# EAGLE schematic Companion_bot_schematic (EAGLE 9.7.0)
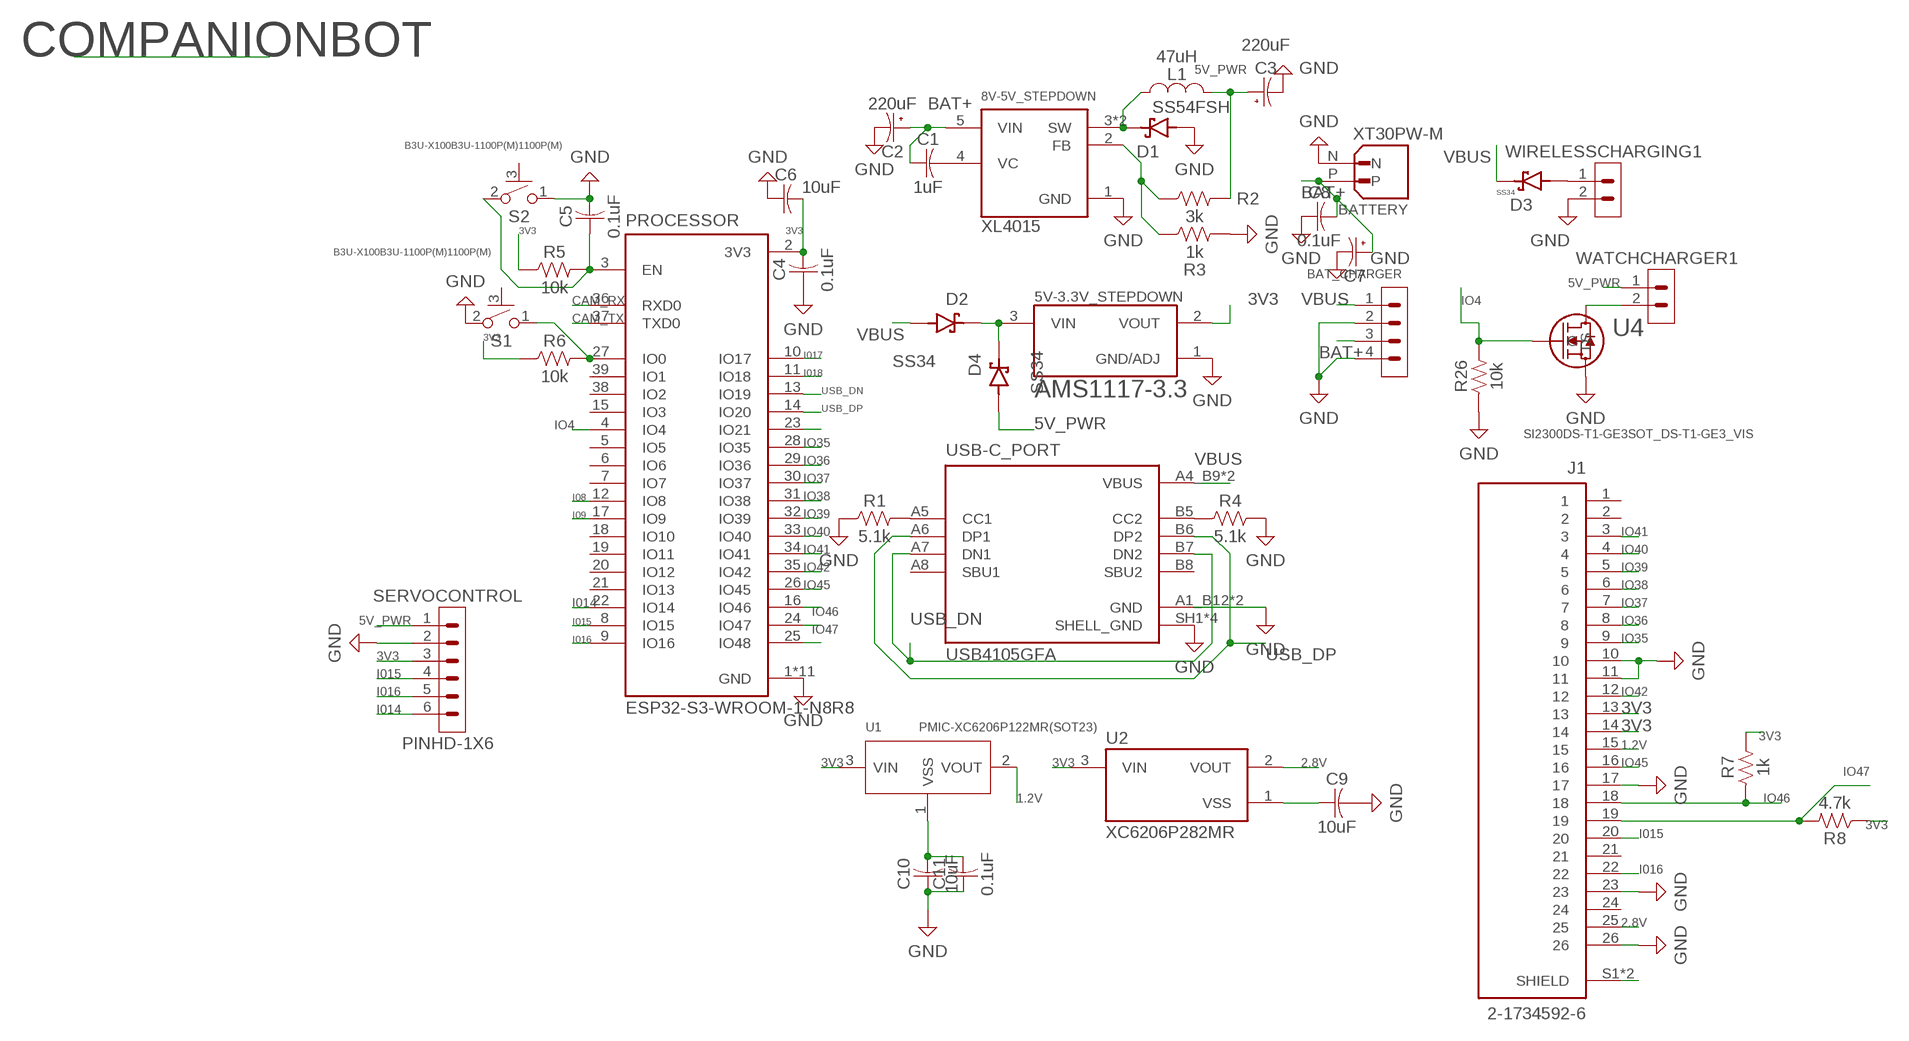
[diagram p0: schematic, sheet 1]

## Parts
5V-3.3V_STEPDOWN  AMS1117-3.3  [SOT229P700X180-4N]
8V-5V_STEPDOWN  XL4015  [CONV_XL4015]
BAT_CHARGER  PINHD-1X4  [1X04]
BATTERY  XT30PW-M  [AMASS_XT30PW-M]
C1  1uF  C-US_CHIP-0402(1005-METRIC)  [CAPC1005X60]
C2  220uF  C-POL-US_TANTALUM-1206(3216-METRIC)  [CAPMP3216X180N]
C3  220uF  C-POL-US_TANTALUM-1206(3216-METRIC)  [CAPMP3216X180N]
C4  0.1uF  C-US_CHIP-0402(1005-METRIC)  [CAPC1005X60]
C5  0.1uF  C-US_CHIP-0402(1005-METRIC)  [CAPC1005X60]
C6  10uF  C-US_CHIP-0402(1005-METRIC)  [CAPC1005X60]
C7  C-POL-US_TANTALUM-1206(3216-METRIC)  [CAPMP3216X180N]
C8  0.1uF  C-US_CHIP-0402(1005-METRIC)  [CAPC1005X60]
C9  10uF  C-US_CHIP-0402(1005-METRIC)  [CAPC1005X60]
C10  10uF  C-US_CHIP-0402(1005-METRIC)  [CAPC1005X60]
C11  0.1uF  C-US_CHIP-0402(1005-METRIC)  [CAPC1005X60]
D1  SS54FSH  [SODFL4725X110N]
D2  SS34  [DIO_SS34]
D3  SS34  [DIO_SS34]
D4  SS34  [DIO_SS34]
J1  2-1734592-6  [TE_2-1734592-6]
L1  47uH  L_CHIP-0402(1006-METRIC)  [INDC1006X60N]
PROCESSOR  ESP32-S3-WROOM-1-N8R8  [XCVR_ESP32S3WROOM1N8R8]
R1  5.1k  R-US_CHIP-0402(1005-METRIC)  [RESC1005X40]
R2  3k  R-US_CHIP-0402(1005-METRIC)  [RESC1005X40]
R3  1k  R-US_CHIP-0402(1005-METRIC)  [RESC1005X40]
R4  5.1k  R-US_CHIP-0402(1005-METRIC)  [RESC1005X40]
R5  10k  R-US_CHIP-0402(1005-METRIC)  [RESC1005X40]
R6  10k  R-US_CHIP-0402(1005-METRIC)  [RESC1005X40]
R7  1k  R-US_CHIP-0402(1005-METRIC)  [RESC1005X40]
R8  4.7k  R-US_CHIP-0402(1005-METRIC)  [RESC1005X40]
R26  10k  R-US_CHIP-0402(1005-METRIC)  [RESC1005X40]
S1  B3U-X100B3U-1100P(M)1100P(M)  [B3U-1100P(M)]
S2  B3U-X100B3U-1100P(M)1100P(M)  [B3U-1100P(M)]
SERVOCONTROL  PINHD-1X6  [1X06]
U1  PMIC-XC6206P122MR(SOT23)  [SOT-23]
U2  XC6206P282MR  [VREG_XC6206P282MR]
U4  SI2300DS-T1-GE3SOT_DS-T1-GE3_VIS  [SOT_DS-T1-GE3_VIS]
USB-C_PORT  USB4105GFA  [GCT_USB4105GFA]
WATCHCHARGER1  PINHD-1X2  [1X02]
WIRELESSCHARGING1  PINHD-1X2  [1X02]

## Nets
1.2V: J1.15 U1.2(VOUT)
2.8V: J1.25 U2.2(VOUT)
3V3: 5V-3.3V_STEPDOWN.2(VOUT) C4.2 C6.2 J1.13 J1.14 PROCESSOR.2(3V3) R5.1 R6.1 R7.2 R8.1 SERVOCONTROL.3 U1.3(VIN) U2.3(VIN)
5V_PWR: C3.1(+) D4.A L1.2 R2.2 SERVOCONTROL.1 WATCHCHARGER1.1
BAT+: 8V-5V_STEPDOWN.5(VIN) BAT_CHARGER.3 BATTERY.P C1.1 C2.1(+) C7.1(+) C8.2
CAM_RX: PROCESSOR.36(RXD0)
CAM_TX: PROCESSOR.37(TXD0)
GND: 5V-3.3V_STEPDOWN.1(GND/ADJ) 8V-5V_STEPDOWN.1(GND) BAT_CHARGER.2 BAT_CHARGER.4 BATTERY.N C2.2(-) C3.2(-) C4.1 C5.2 C6.1 C7.2(-) C8.1 C9.2 C10.1 C11.1 D1.A J1.10 J1.11 J1.17 J1.23 J1.26 PROCESSOR.1(GND) PROCESSOR.40(GND) PROCESSOR.41_1(GND) PROCESSOR.41_2(GND) PROCESSOR.41_3(GND) PROCESSOR.41_4(GND) PROCESSOR.41_5(GND) PROCESSOR.41_6(GND) PROCESSOR.41_7(GND) PROCESSOR.41_8(GND) PROCESSOR.41_9(GND) R1.1 R3.2 R4.2 R26.1 S1.2 S2.1 SERVOCONTROL.2 U4.3(S) USB-C_PORT.A1_B12(GND) USB-C_PORT.B1_A12(GND) USB-C_PORT.SH1(SHELL_GND) USB-C_PORT.SH2(SHELL_GND) USB-C_PORT.SH3(SHELL_GND) USB-C_PORT.SH4(SHELL_GND) WIRELESSCHARGING1.2
I08: PROCESSOR.12(IO8)
I09: PROCESSOR.17(IO9)
I014: PROCESSOR.22(IO14) SERVOCONTROL.6
I015: J1.20 PROCESSOR.8(IO15) SERVOCONTROL.4
I016: J1.22 PROCESSOR.9(IO16) SERVOCONTROL.5
I017: PROCESSOR.10(IO17)
I018: PROCESSOR.11(IO18)
IO4: PROCESSOR.4(IO4) R26.2 U4.1(G)
IO35: J1.9 PROCESSOR.28(IO35)
IO36: J1.8 PROCESSOR.29(IO36)
IO37: J1.7 PROCESSOR.30(IO37)
IO38: J1.6 PROCESSOR.31(IO38)
IO39: J1.5 PROCESSOR.32(IO39)
IO40: J1.4 PROCESSOR.33(IO40)
IO41: J1.3 PROCESSOR.34(IO41)
IO42: J1.12 PROCESSOR.35(IO42)
IO45: J1.16 PROCESSOR.26(IO45)
IO46: J1.18 PROCESSOR.16(IO46) R7.1
IO47: J1.19 PROCESSOR.24(IO47) R8.2
N$1: R1.2 USB-C_PORT.A5(CC1)
N$2: R4.1 USB-C_PORT.B5(CC2)
N$3: 8V-5V_STEPDOWN.4(VC) C1.2
N$4: 8V-5V_STEPDOWN.3(SW) 8V-5V_STEPDOWN.3.1(SW) D1.C(K) L1.1
N$5: 8V-5V_STEPDOWN.2(FB) R2.1 R3.1
N$6: C5.1 PROCESSOR.3(EN) R5.2 S2.2
N$7: PROCESSOR.27(IO0) R6.2 S1.1
N$8: PROCESSOR.23(IO21)
N$9: 5V-3.3V_STEPDOWN.3(VIN) D2.C(K) D4.C(K)
N$13: C9.1 U2.1(VSS)
N$20: PROCESSOR.25(IO48)
N$41: U4.2(D) WATCHCHARGER1.2
N$44: D3.A WIRELESSCHARGING1.1
N$50: J1.S1(SHIELD) J1.S2(SHIELD)
USB_DN: PROCESSOR.13(IO19) USB-C_PORT.A7(DN1) USB-C_PORT.B7(DN2)
USB_DP: PROCESSOR.14(IO20) USB-C_PORT.A6(DP1) USB-C_PORT.B6(DP2)
VBUS: BAT_CHARGER.1 D2.A D3.C(K) USB-C_PORT.A4_B9(VBUS) USB-C_PORT.B4_A9(VBUS)
VSS: C10.2 C11.2 U1.1(VSS)
Unconnected: J1.1 J1.2 J1.21 J1.24 PROCESSOR.5(IO5) PROCESSOR.6(IO6) PROCESSOR.7(IO7) PROCESSOR.15(IO3) PROCESSOR.18(IO10) PROCESSOR.19(IO11) PROCESSOR.20(IO12) PROCESSOR.21(IO13) PROCESSOR.38(IO2) PROCESSOR.39(IO1) S1.3 S2.3 USB-C_PORT.A8(SBU1) USB-C_PORT.B8(SBU2)

## Library data of the parts
5V-3.3V_STEPDOWN = AMS1117-3.3:AMS1117-3.3: Check availability <https://pricing.snapeda.com/parts/AMS1117-3.3/Advanced%20Monolithic%20Systems/view-part?ref=eda>; AVAILABILITY: Not in stock; CHECK_PRICES: https://www.snapeda.com/parts/AMS1117-3.3/Advanced+Monolithic+Systems/view-part/?ref=eda; DESCRIPTION: Sot223/Pkg 1-Amp 3.3-Volt Low Drop Out Voltage Regulatator; MF: Advanced Monolithic Systems; MP: AMS1117-3.3; PACKAGE: SOT-223 Seeed Technology; PRICE: None; SNAPEDA_LINK: https://www.snapeda.com/parts/AMS1117-3.3/Advanced+Monolithic+Systems/view-part/?ref=snap
8V-5V_STEPDOWN = XL4015:XL4015: Check availability <https://pricing.snapeda.com/parts/XL4015/XLSEMI/view-part?ref=eda>; AVAILABILITY: Not in stock; CHECK_PRICES: https://www.snapeda.com/parts/XL4015/XLSEMI/view-part/?ref=eda; DESCRIPTION: 5A 180KHz 36V Buck DC to DC Converter; MF: XLSEMI; MP: XL4015; PACKAGE: None; PRICE: None; SNAPEDA_LINK: https://www.snapeda.com/parts/XL4015/XLSEMI/view-part/?ref=snap
BAT_CHARGER = Connector:PINHD-1X4: Pin Header; CATEGORY: Connectors; DESCRIPTION: Header-Straight-4 Position; PACKAGE_TYPE: Through Hole; PITCH: 0.100" (2.54mm); SUBCATEGORY: Headers; TYPE: Male Pins
BATTERY = XT30PW-M:XT30PW-M: Check availability <https://pricing.snapeda.com/parts/XT30PW-M/AMASS/view-part?ref=eda>; AVAILABILITY: In Stock; CHECK_PRICES: https://www.snapeda.com/parts/XT30PW-M/AMASS/view-part/?ref=eda; DESCRIPTION: Socket; DC supply; XT30; male; PIN: 2; on PCBs; THT; Colour: yellow; MF: AMASS; MP: XT30PW-M; PACKAGE: None; PRICE: None; SNAPEDA_LINK: https://www.snapeda.com/parts/XT30PW-M/AMASS/view-part/?ref=snap
C1 C4-C6 C8-C11 = Capacitor:C-US: Capacitor - ANSI; CATEGORY: Capacitor; PACKAGE_SIZE: 0402; PACKAGE_TYPE: Surface Mount; SUBCATEGORY: Ceramic Capacitors; TYPE: MLCC
C2 C3 C7 = Capacitor:C-POL-US: Capacitor Polarised - ANSI; CATEGORY: Capacitor; PACKAGE_SIZE: 1206; PACKAGE_TYPE: Surface Mount; SUBCATEGORY: Tantalum Capacitors; TYPE: Polymer Capacitors
D1 = SS54FSH:SS54FSH: Check availability <https://pricing.snapeda.com/parts/SS54FSH/Taiwan%20Semiconductor/view-part?ref=eda>; AVAILABILITY: In Stock; CHECK_PRICES: https://www.snapeda.com/parts/SS54FSH/taiwan/view-part/?ref=eda; DESCRIPTION: 5A, 40V, Automotive Planar Schottky; MF: Taiwan Semiconductor; MP: SS54FSH; PACKAGE: SOD-128-2 Taiwan Semiconductor; PRICE: None; SNAPEDA_LINK: https://www.snapeda.com/parts/SS54FSH/taiwan/view-part/?ref=snap
D2-D4 = SS34:SS34: Check availability <https://pricing.snapeda.com/parts/SS34/Taiwan%20Semiconductor/view-part?ref=eda>; AVAILABILITY: In Stock; CHECK_PRICES: https://www.snapeda.com/parts/SS34/taiwan/view-part/?ref=eda; DESCRIPTION: 3A, 40V, Planar Schottky; MF: Taiwan Semiconductor; MP: SS34; PACKAGE: DO-214AB-2 Taiwan Semiconductor; PRICE: None; PURCHASE-URL: https://www.snapeda.com/api/url_track_click_mouser/?unipart_id=4810221&manufacturer=Taiwan Semiconductor&part_name=SS34&search_term=ss34; SNAPEDA_LINK: https://www.snapeda.com/parts/SS34/taiwan/view-part/?ref=snap
J1 = 2-1734592-6:2-1734592-6: Check availability <https://pricing.snapeda.com/parts/2-1734592-6/TE%20Connectivity/view-part?ref=eda>; AVAILABILITY: In Stock; CHECK_PRICES: https://www.snapeda.com/parts/2-1734592-6/TE+Connectivity+AMP+Connectors/view-part/?ref=eda; COMMENT: 2-1734592-6; DESCRIPTION: 26 Position FPC Connector Contacts, Bottom 0.020 (0.50mm) Surface Mount, Right Angle; EU_ROHS_COMPLIANCE: Compliant; MF: TE Connectivity; MP: 2-1734592-6; PACKAGE: None; PRICE: None; SNAPEDA_LINK: https://www.snapeda.com/parts/2-1734592-6/TE+Connectivity+AMP+Connectors/view-part/?ref=snap
L1 = Inductor:L: Inductor Fixed - Generic; CATEGORY: Inductors; DESCRIPTION: Chip 1.00 X 0.60 X 0.60 mm body 0402(1006-METRIC); PACKAGE_SIZE: 0402; PACKAGE_TYPE: Surface Mount
PROCESSOR = ESP32-S3-WROOM-1-N8R8:ESP32-S3-WROOM-1-N8R8: Check availability <https://pricing.snapeda.com/parts/ESP32-S3-WROOM-1-N8R8/Espressif%20Systems/view-part?ref=eda>; AVAILABILITY: In Stock; CHECK_PRICES: https://www.snapeda.com/parts/ESP32-S3-WROOM-1-N8R8/Espressif+Systems/view-part/?ref=eda; DESCRIPTION: Bluetooth, WiFi 802.11b/g/n, Bluetooth v5.0 Transceiver Module 2.4GHz PCB Trace Surface Mount; MF: Espressif Systems; MP: ESP32-S3-WROOM-1-N8R8; PACKAGE: NON STANDARD Espressif Systems; PRICE: None; PURCHASE-URL: https://www.snapeda.com/api/url_track_click_mouser/?unipart_id=8936581&manufacturer=Espressif Systems&part_name=ESP32-S3-WROOM-1-N8R8&search_term=esp32-s3-wroom-1; SNAPEDA_LINK: https://www.snapeda.com/parts/ESP32-S3-WROOM-1-N8R8/Espressif+Systems/view-part/?ref=snap
R1-R8 R26 = Resistor:R-US: Resistor Fixed - ANSI; CATEGORY: Resistors; DESCRIPTION: Chip Resistor 1.05 X 0.54 X 0.40 mm body 0402(1005-METRIC) Package; PACKAGE_SIZE: 0402; PACKAGE_TYPE: Surface Mount
S1 S2 = Switch:B3U-X100: Ultra-small Tactile Switch Contact form : SPST-NO Reference: Datasheet <https://omronfs.omron.com/en_US/ecb/products/pdf/en-b3u.pdf>; CATEGORY: Switches; DATASHEET: https://omronfs.omron.com/en_US/ecb/products/pdf/en-b3u.pdf; DESCRIPTION: Tactile Switch SPST-NO Top Actuated Surface Mount; MANUFACTURER: Omron Electronics Inc-EMC Div; MPN: B3U-1100PM; OPERATING_TEMPERATURE: -25°C ~ 70°C; PACKAGE_SIZE: NA; PACKAGE_TYPE: SMD; PART_STATUS: ACTIVE; ROHS: COMPLIANT; SERIES: B3U; SUBCATEGORY: Tactile Switches; TYPE: SPST-NO
SERVOCONTROL = Connector:PINHD-1X6: Pin Header; CATEGORY: Connectors; DESCRIPTION: Header-Straight-6 Position; PACKAGE_TYPE: Through Hole; PITCH: 0.100" (2.54mm); SUBCATEGORY: Headers; TYPE: Male Pins
U1 = PMIC-XC6206P122MR_SOT23_:PMIC-XC6206P122MR(SOT23): Check availability <https://pricing.snapeda.com/parts/XC6206P122MR/Torex/view-part?ref=eda>; AVAILABILITY: In Stock; CHECK_PRICES: https://www.snapeda.com/parts/XC6206P122MR/Torex/view-part/?ref=eda; DESCRIPTION: Linear Voltage Regulator IC Positive Fixed 1 Output 60mA SOT-23; MF: Torex; MP: XC6206P122MR; PACKAGE: None; PRICE: None; SNAPEDA_LINK: https://www.snapeda.com/parts/XC6206P122MR/Torex/view-part/?ref=snap
U2 = XC6206P282MR:XC6206P282MR: Check availability <https://pricing.snapeda.com/parts/XC6206P282MR/Torex%20Semiconductor%20Ltd/view-part?ref=eda>; AVAILABILITY: In Stock; CHECK_PRICES: https://www.snapeda.com/parts/XC6206P282MR/Torex/view-part/?ref=eda; DESCRIPTION: Linear Voltage Regulator IC Positive Fixed 1 Output 150mA SOT-23; MF: Torex Semiconductor Ltd; MP: XC6206P282MR; PACKAGE: None; PRICE: None; SNAPEDA_LINK: https://www.snapeda.com/parts/XC6206P282MR/Torex/view-part/?ref=snap
U4 = 2026-03-09_07-57-06_Library:SI2300DS-T1-GE3; COPYRIGHT: Copyright (C) 2026 Ultra Librarian. All rights reserved.; DATASHEET: https://www.vishay.com/doc?65701; DESCRIPTION: N-CHANNEL 30-V (D-S) MOSFET; MANUFACTURER_NAME: Vishay; MANUFACTURER_PART_NUMBER: SI2300DS-T1-GE3
USB-C_PORT = USB4105GFA:USB4105GFA: Check availability <https://pricing.snapeda.com/parts/USB4105GFA/Global%20Connector%20Technology/view-part?ref=eda>; AVAILABILITY: In Stock; CHECK_PRICES: https://www.snapeda.com/parts/USB4105GFA/Global+Connector+Technology/view-part/?ref=eda; DESCRIPTION: USB-C (USB TYPE-C) USB 2.0 Receptacle Connector 24 (16+8 Dummy) Position Surface Mount, Right Angle; Through Hole; MF: Global Connector Technology; MP: USB4105GFA; PACKAGE: None; PRICE: None; PURCHASE-URL: https://www.snapeda.com/api/url_track_click_mouser/?unipart_id=8191105&manufacturer=Global Connector Technology&part_name=USB4105GFA&search_term=usb4105; SNAPEDA_LINK: https://www.snapeda.com/parts/USB4105GFA/Global+Connector+Technology/view-part/?ref=snap
WATCHCHARGER1 WIRELESSCHARGING1 = Connector:PINHD-1X2: Pin Header; CATEGORY: Connectors; DESCRIPTION: Header-Straight-2 Position; PACKAGE_TYPE: Through Hole; PITCH: 0.100" (2.54mm); SUBCATEGORY: Headers; TYPE: Male Pins